# EAGLE design ArduinoClock (EAGLE 9.6.2)
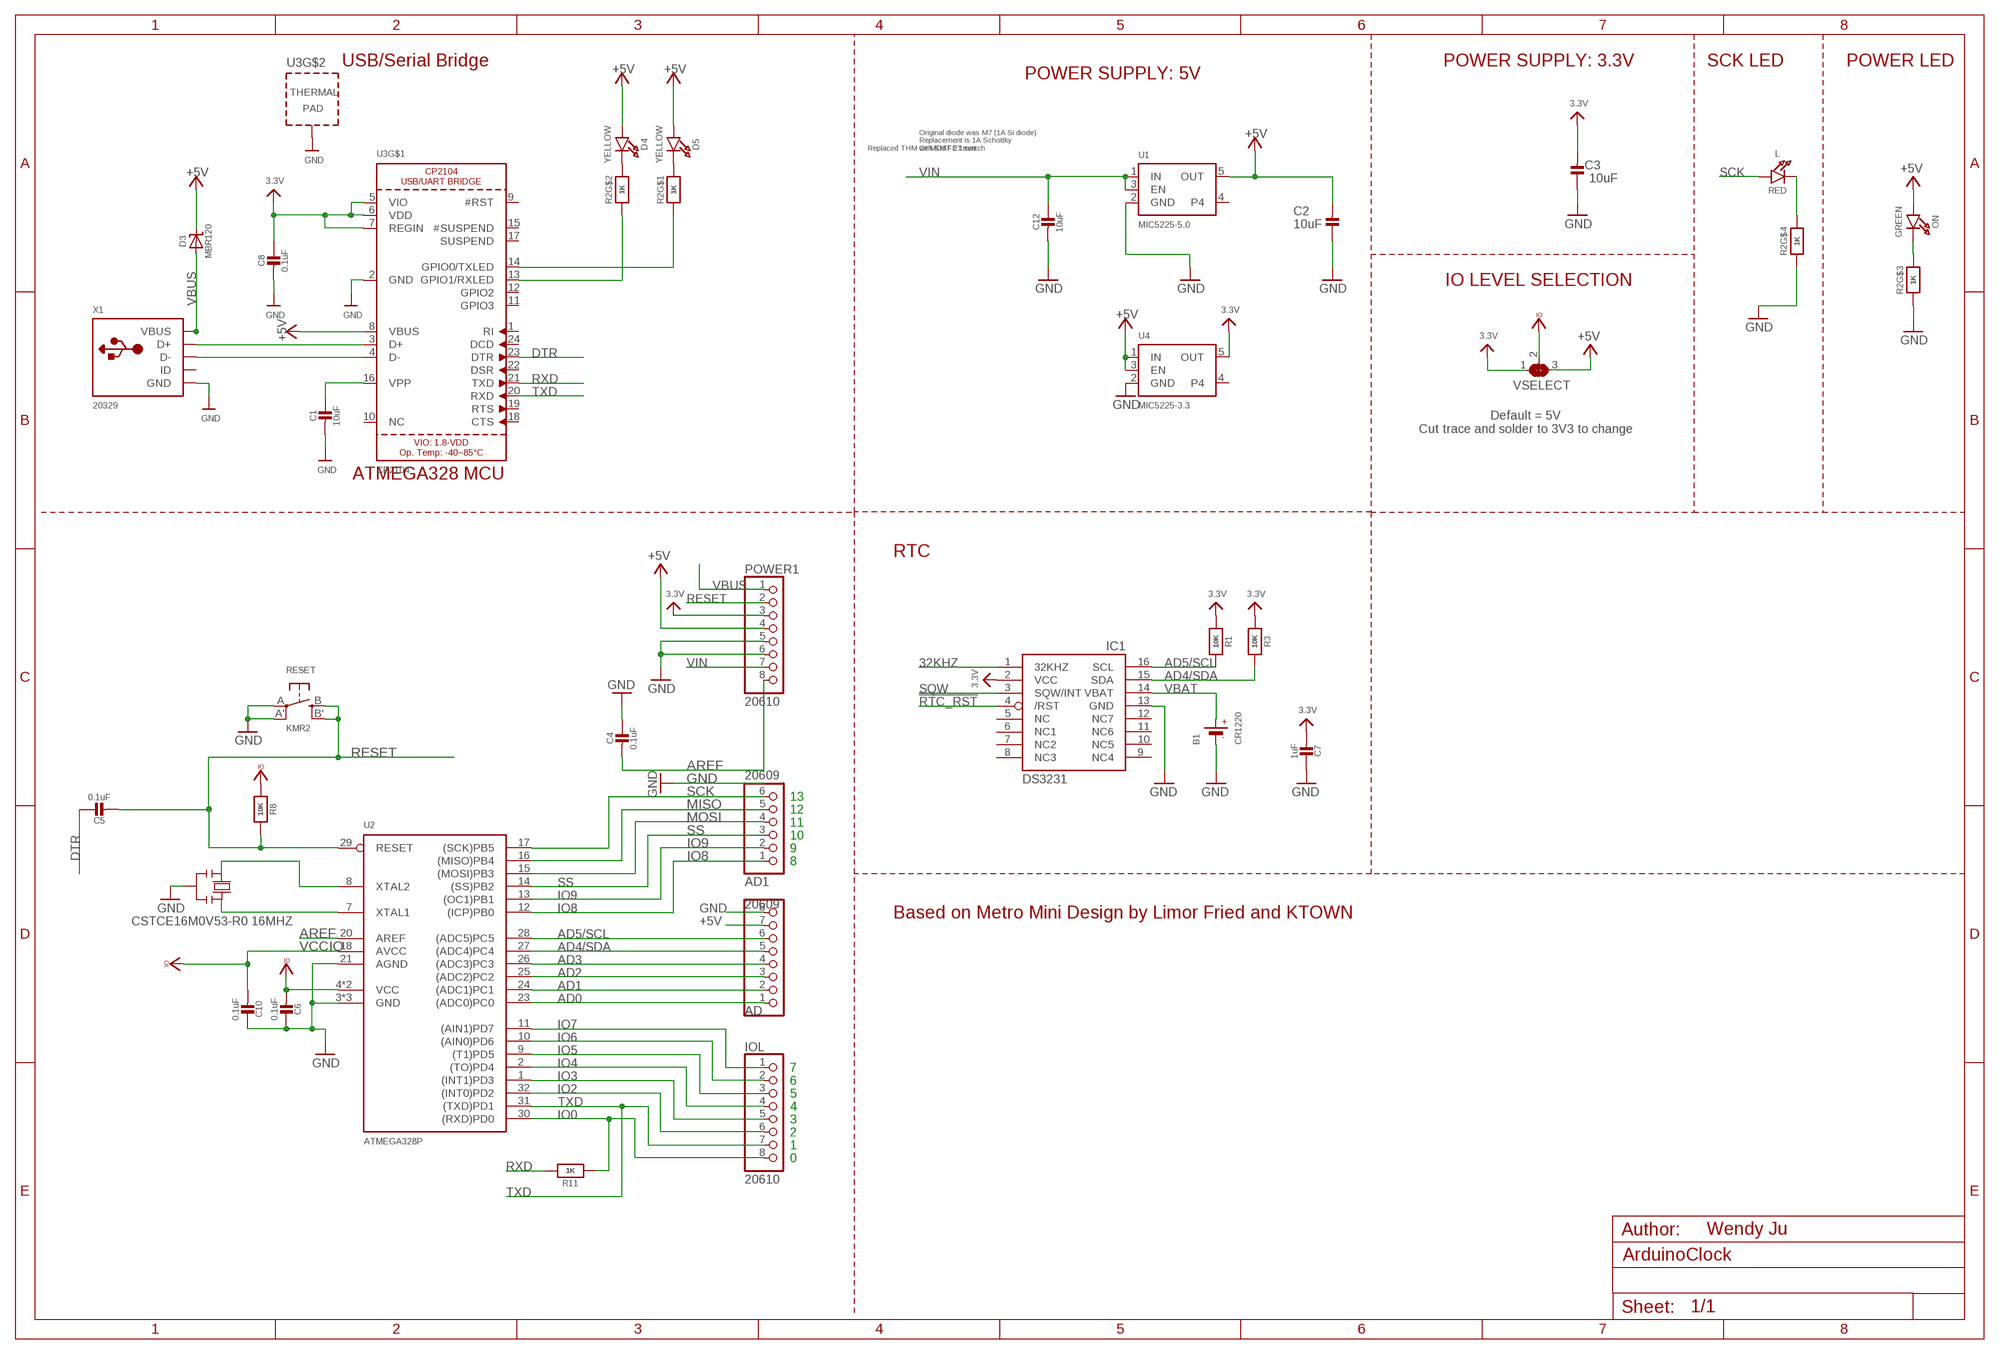
[diagram p0: schematic, sheet 1]

## Parts
AD  20609  HEADER-1X8ROUND  [1X08_ROUND]
AD1  20609  HEADER-1X6ROUND  [1X06_ROUND]
B1  CR1220  BATTERYCR1220_SMT  [CR1220]
C1  10uF  CAP_CERAMIC0805-NOOUTLINE  [0805-NO]
C2  10uF  CAP_CERAMIC0805-NOOUTLINE  [0805-NO]
C3  10uF  CAP_CERAMIC0805-NOOUTLINE  [0805-NO]
C4  0.1uF  CAP_CERAMIC0805-NOOUTLINE  [0805-NO]
C5  0.1uF  CAP_CERAMIC_0805MP  [_0805MP]
C6  0.1uF  CAP_CERAMIC0805-NOOUTLINE  [0805-NO]
C7  1uF  CAP_CERAMIC0805-NOOUTLINE  [0805-NO]
C8  0.1uF  CAP_CERAMIC0805-NOOUTLINE  [0805-NO]
C10  0.1uF  CAP_CERAMIC0805-NOOUTLINE  [0805-NO]
C12  10uF  CAP_CERAMIC0805-NOOUTLINE  [0805-NO]
D3  MBR120  DIODE-SCHOTTKYSOD-123  [SOD-123]
D4  YELLOW  LED0805_NOOUTLINE  [CHIPLED_0805_NOOUTLINE]
D5  YELLOW  LED0805_NOOUTLINE  [CHIPLED_0805_NOOUTLINE]
IC1  DS3231/SO  [SO16W]
IOL  20610  HEADER-1X8ROUND  [1X08_ROUND]
L  RED  LED0805_NOOUTLINE  [CHIPLED_0805_NOOUTLINE]
ON  GREEN  LED0805_NOOUTLINE  [CHIPLED_0805_NOOUTLINE]
POWER1  20610  HEADER-1X870MIL  [1X08_ROUND_70]
R1  10K  RESISTOR0805_NOOUTLINE  [0805-NO]
R2  1K  RESISTOR_4PACK  [RESPACK_4X0603]
R3  10K  RESISTOR0805_NOOUTLINE  [0805-NO]
R8  10K  RESISTOR0805_NOOUTLINE  [0805-NO]
R11  1K  RESISTOR0805_NOOUTLINE  [0805-NO]
RESET  KMR2  SWITCH_TACT_SMT4.6X2.8  [BTN_KMR2_4.6X2.8]
U1  MIC5225-5.0  VREG_SOT23-5  [SOT23-5]
U2  ATMEGA328P  [MLF32-TH]
U3  CP2104  [QFN24_4MM_SMSC]
U4  MIC5225-3.3  VREG_SOT23-5  [SOT23-5]
VSELECT  SOLDERJUMPER_2WAY  [SOLDERJUMPER_2WAY_OPEN_NOPASTE]
X1  20329  USB_MICRO_20329_V2  [4UCONN_20329_V2]
Y2  CSTCE16M0V53-R0 16MHZ  RESONATORMU  [RESONATOR]

## Nets
3.3V: C3.2 C7.2 C8.1 IC1.2(VCC) POWER1.3 R1.1 R3.1 U3.5(VIO) U3.6(VDD) U3.7(REGIN) U4.5(OUT) VSELECT.1
32KHZ: IC1.1(32KHZ)
!RTC_RST: IC1.4(/RST)
+5V [usbvcc]: AD.7 C2.2 D3.C D4.A D5.A ON.A POWER1.4 U1.5(OUT) U3.8(VBUS) U4.1(IN) U4.3(EN) VSELECT.3
AD0: AD.1 U2.23((ADC0)PC0)
AD1: AD.2 U2.24((ADC1)PC1)
AD2: AD.3 U2.25((ADC2)PC2)
AD3: AD.4 U2.26((ADC3)PC3)
AD4/SDA: AD.5 IC1.15(SDA) R3.2 U2.27((ADC4)PC4)
AD5/SCL: AD.6 IC1.16(SCL) R1.2 U2.28((ADC5)PC5)
AREF [aref]: C4.2 POWER1.8 U2.20(AREF)
DTR: C5.1 U3.23(DTR)
GND [power]: AD.8 B1.- C1.2 C2.1 C3.1 C4.1 C6.1 C7.1 C8.2 C10.1 C12.2 IC1.13(GND) POWER1.5 POWER1.6 R2.3 R2.4 RESET.A'(P1) RESET.A(P) U1.2(GND) U2.3(GND) U2.5(GND) U2.21(AGND) U2.TH(GND) U3.2(GND) U3.THERM(TP) U4.2(GND) X1.BASE@1(GND) X1.BASE@2(GND) X1.GND X1.SPRT@1(GND) X1.SPRT@2(GND) X1.SPRT@3(GND) X1.SPRT@4(GND) Y2.2
IO0: IOL.8 R11.1 U2.30((RXD)PD0)
IO2: IOL.6 U2.32((INT0)PD2)
IO3: IOL.5 U2.1((INT1)PD3)
IO4: IOL.4 U2.2((TO)PD4)
IO5: IOL.3 U2.9((T1)PD5)
IO6: IOL.2 U2.10((AIN0)PD6)
IO7: IOL.1 U2.11((AIN1)PD7)
IO8: AD1.1 U2.12((ICP)PB0)
IO9: AD1.2 U2.13((OC1)PB1)
MISO: AD1.5 U2.16((MISO)PB4)
MOSI: AD1.4 U2.15((MOSI)PB3)
N$1: L.C R2.5
N$3: ON.C R2.6
N$4: R2.1 U3.14(GPIO0/TXLED)
N$6: D4.C R2.7
N$7: D5.C R2.8
N$8: U3.3(D+) X1.D+
N$11: U3.4(D-) X1.D-
N$12: C1.1 U3.16(VPP)
N$15: R2.2 U3.13(GPIO1/RXLED)
RESET: C5.2 POWER1.2 R8.1 RESET.B'(S1) RESET.B(S) U2.29(RESET)
RXD: R11.2 U3.21(TXD)
SCK: AD1.6 L.A U2.17((SCK)PB5)
SQW: IC1.3(SQW/INT)
SS: AD1.3 U2.14((SS)PB2)
TXD: IOL.7 U2.31((TXD)PD1) U3.20(RXD)
VBAT: B1.+$1(+) IC1.14(VBAT)
VBUS: D3.A POWER1.1 X1.VBUS
VCCIO [usbvcc]: C6.2 C10.2 R8.2 U2.4(VCC) U2.6(VCC) U2.18(AVCC) VSELECT.2
VIN [power]: C12.1 POWER1.7 U1.1(IN) U1.3(EN)
XTAL1: U2.7(XTAL1) Y2.3
XTAL2: U2.8(XTAL2) Y2.1
Unconnected: IC1.5(NC) IC1.6(NC1) IC1.7(NC2) IC1.8(NC3) IC1.9(NC4) IC1.10(NC5) IC1.11(NC6) IC1.12(NC7) U1.4 U3.1(RI) U3.9(#RST) U3.10(NC) U3.11(GPIO3) U3.12(GPIO2) U3.15(#SUSPEND) U3.17(SUSPEND) U3.18(CTS) U3.19(RTS) U3.22(DSR) U3.24(DCD) U4.4 X1.ID

## Notes on the sheet
- USB/Serial Bridge | POWER SUPPLY: 3.3V | SCK LED | POWER LED
- POWER SUPPLY: 5V
- Replaced THM with SMT 2.1mm
- Original diode was M7 (1A Si diode)
  Replacement is 1A Schottky
  Or MOSFET switch
- IO LEVEL SELECTION
- Default = 5V
  Cut trace and solder to 3V3 to change
- ATMEGA328 MCU
- RTC
- 13
- 12
- 11
- 10
- 9
- 8
- Based on Metro Mini Design by Limor Fried and KTOWN
- 7
- 6
- 5
- 4
- 3
- 2
- 1
- 0
- Wendy Ju

## Library data of the parts
AD IOL POWER1 = microbuilder:HEADER-1X8: PIN HEADER
AD1 = microbuilder:HEADER-1X6: PIN HEADER
B1 = microbuilder:BATTERY: CR1220 SMT - Digikey: 3001K-ND CD2032 BAT-HLD-001 - Digikey: BAT-HLD-001-ND
C1-C8 C10 C12 = microbuilder:CAP_CERAMIC: Ceramic Capacitors For new designs, use the packages preceded by an '_' character since they are more reliable: The following footprints should be used on most boards: _0402 - Standard footprint for regular board layouts _0603 - Standard footprint for regular board layouts _0805 - Standard footprint for regular board layouts _1206 - Standard footprint for regular board layouts For extremely tight-pitch boards where space is at a premium, the following 'micro-pitch' footprints can be used (smaller pads, no silkscreen outline, etc.): _0402MP - Micro-pitch footprint for very dense/compact boards _0603MP - Micro-pitch footprint for very dense/compact boards _0805MP - Micro-pitch footprint for very dense/compact boards _1206MP - Micro-pitch footprint for very dense/compact boards
D3 = microbuilder:DIODE-SCHOTTKY
D4 D5 L ON = microbuilder:LED: LED 0603 - 0603 Surface Mount Package 2mA: Green LED - Low Power (3.9mcd, 2ma, 1.7Vf) - Digikey: 475-2709-2-ND Orange LED - Low Power (9.8mcd, 2ma, 1.8Vf) - Digikey: 475-1194-2-ND Red LED - Low Power (5mcd, 2ma, 1.8Vf) - Digikey: 475-1195-2-ND Yellow LED - Low Power (7mcd, 2ma, 1.8Vf) - Digikey: 475-1196-2-ND 5mA: Blue LED - Low Power (17mcd, 5ma, 2.9Vf) - Digikey: LNJ937W8CRACT-ND 0805 - 0805 Surface Mount Package 2mA: Red LED (8.8mcd, 2mA, 1.8Vf, Clear) - Low Power [Digikey: 475-2510-1-ND] Green LED (5mcd, 2mA, 1.8Vf, Clear) - Low Power [Digikey: 475-2730-1-ND] Yellow LED (11.3mcd, 2mA, 1.8Vf, Clear) - Low Power [Digikey: 475-2555-1-ND] 20mA: Red LED (104mcd, 20mA, Diffused) - LS R976 [Digikey: 475-1278-6-ND] Red LED (12mcd, 20mA, 2.0Vf, Clear) - APT2012EC [Digikey: 754-1128-1-ND] Green LED (15mcd, 20mA, 2.2Vf, Clear) - APT2012GC [Digikey: 754-1131-1-ND] Orange LED (160mcd, 20mA, 2.1Vf, Clear) - APT2012SECK [Digikey: 754-1130-1-ND] 1206 - 1206 Surface Mount Package Green LED (26mcd, 20mA, Diffused) - LG N971 [Digikey: 475-1407-6-ND] Red LED (15mcd, 20mA, Diffused) - LH N974 [Digikey: 475-1416-6-ND] Cree - Cree High-Power Surface Mount LEDs XPEBWT-L1-0000-00D50 - White 111lm 350mA 2.9Vf 6200K 110° XTEAWT-00-0000-00000LEE3 - White 114lm 350mA 2.85Vf 5000K 115° Everlight - Everlight 45-21 Series Surface Mount LEDs 45-21/QK2C-B2832AC2CB2/2T - Warm White 2000mcd 20mA 3.25Vf 3050K 120° 45-21/LK2C-B38452C4CB2/2T - Nuetral White 2000mcd 20mA 3.25Vf 4150K 120° 45-21/LK2C-B50634C6CB2/2T - Cold White 2200mcd 20mA 3.25Vf 5650K 120° PLCC2 Reverse Mount LS T77K-J1L2-1-0-2-R18-Z - Red 11.25mcd 2mA 1.8Vf 630nm 120° LO T77K-L1M2-24-Z - Orange 19.6mcd 2mA 1.8Vf 606nm 120° LY T77K-K2M1-26-Z - Yellow 15.7mcd 2mA 1.8Vf 587nm 120°
IC1 = adafruit:DS3231
R1 R3 R8 R11 = microbuilder:RESISTOR: Resistors For new designs, use the packages preceded by an '_' character since they are more reliable: The following footprints should be used on most boards: _0402 - Standard footprint for regular board layouts _0603 - Standard footprint for regular board layouts _0805 - Standard footprint for regular board layouts _1206 - Standard footprint for regular board layouts For extremely tight-pitch boards where space is at a premium, the following 'micro-pitch' footprints can be used (smaller pads, no silkscreen outline, etc.): _0402MP - Micro-pitch footprint for very dense/compact boards _0603MP - Micro-pitch footprint for very dense/compact boards _0805MP - Micro-pitch footprint for very dense/compact boards _1206MP - Micro-pitch footprint for very dense/compact boards
R2 = microbuilder:RESISTOR_4PACK: Resistor Packs (4 resistors) 4 x 0603 10K 1/16W - Digikey: YC164J-10KCT-ND
RESET = microbuilder:SWITCH_TACT_SMT: SMT Tact Switches 6x6mm - Digikey: P12940SCT-ND KMR2 (4.6x2.8mm) - Digikey: 401-1426-1-ND EVQ-PQHB55 - Light Touch, 160GF (4.5x4.5mm) - Digikey: P8090SCT-ND KMT0 - KMT021 NGJ LHS (etc.) IP68/Waterproof - Digikey: CKN10289CT-ND
U1 U4 = microbuilder:VREG_SOT23-5: SOT23-5 Fixed Voltage Regulators Part Current Out V Out V In V Dropout θJA (°C/W) TJ (°C) Digikey Part No. ADP121 150mA 3.3V 3.4-5.5V 0.09V @ 150mA -- -- ADP121-AUJZ33R7CT-ND ADP121 150mA 3.0V 3.1-5.5V 0.09V @ 150mA -- -- ADP121-AUJZ30R7CT-ND ADP122 300mA 3.3V 3.4-5.5V 0.085V @ 300mA -- -- ADP122AUJZ-3.3-R7CT-ND ADP1712 300mA 3.3V 3.5-5.5V 0.17V @ 300mA -- -- ADP1712AUJZ-3.3-R7TR-ND AP7311 (Low Cost) 150mA 3.3V 3.5-6V 0.15V @ 150mA -- -- AP7311-33WG-7DICT-ND LD39015M18R 150mA 1.8V 1.9V-5.5V 0.08V @ 100mA -- -- 497-6977-1-ND LP2985A-33DBVR 150mA 3.3V 3.3-16V 0.28V @ 150mA 206 150 296-18479-1-ND MCP1824T-3302E/OT 300mA 3.3V 3.5V-6V 0.2V @ 300mA -- -- MCP1824T-3302E/OTCT-ND MIC5205-2.5YM5 TR 150mA 2.5V 2.7-16V 0.165V @ 150mA -- -- 576-1257-2-ND MIC5205-3.0YM5 TR 150mA 3.0V 3.2V-16V 0.165V @ 150mA -- -- 576-1258-2-ND MIC5205-3.3YM5 TR 150mA 3.3V 3.5V-16V 0.165V @ 150mA -- -- 576-1259-2-ND TPS780330220 150mA 3.3V+2.2V 3.6-5.5V 250mV Max -- -- 296-23332-1-ND TDA3663/N1,135 100mA 3.3V 3.5-45V 0.18V @ 50mA -- -- 568-5343-1-ND Max operating temp can be calculated using θJA, TJ (max junction temperature), and power in watts. Set the "Maximum Ambient Temperature" until it reaches TJ ("Max Junction Temperature"), which is the absolute limit for safe use of the regulator: Heat Sink Temperature Calculator <http://www.daycounter.com/Calculators/Heat-Sink-Temperature-Calculator.phtml> For example, With 12V source into a 3.3V LP2985 and a 30mA load, we are dissipating (12V-3.3V) * 0.03A = 0.261W. With a θJA of 206 °C/W, a TJ of 150°C, and 261mW we can safely use the chip without a heat sink up to 75°C (=147.1°C Junction Temperature).
U2 = microbuilder:ATMEGA328P: ATMEGA 328P
U3 = microbuilder:CP2104: CP2104 - USB to UART Bridge VDD Output: 3.45V
VSELECT = microbuilder:SOLDERJUMPER_2WAY: 2-Way Solder Jumper
X1 = microbuilder:USB: USB Connectors USBMINIB - Surface Mount Female Mini-B USB Connector 4UConnector: 06564
Y2 = SmartPrj:RESONATOR

## Net classes
1 power: width 0.305 mm, drill 0.483 mm, clearance 0.203 mm
2 gnd: width 0.305 mm, drill 0.483 mm, clearance 0.203 mm
3 usbvcc: width 0.305 mm, drill 0.483 mm, clearance 0.203 mm
4 aref: width 0.254 mm, drill 0.483 mm, clearance 0.203 mm

## Board
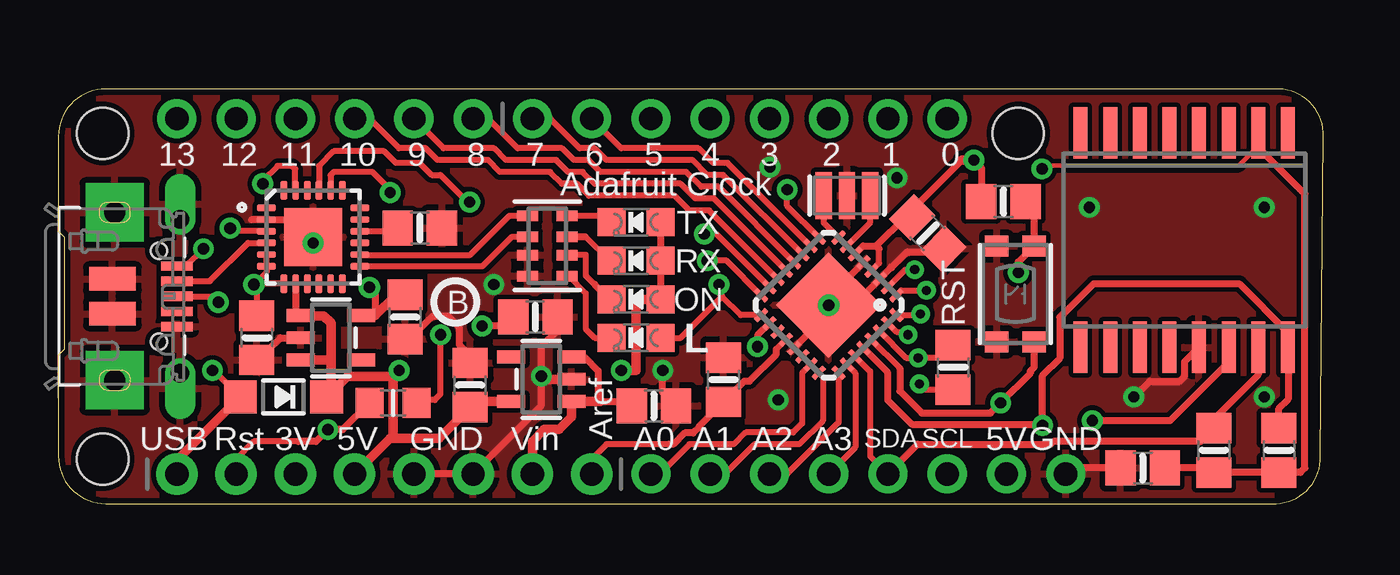
[diagram p1: board, top side]
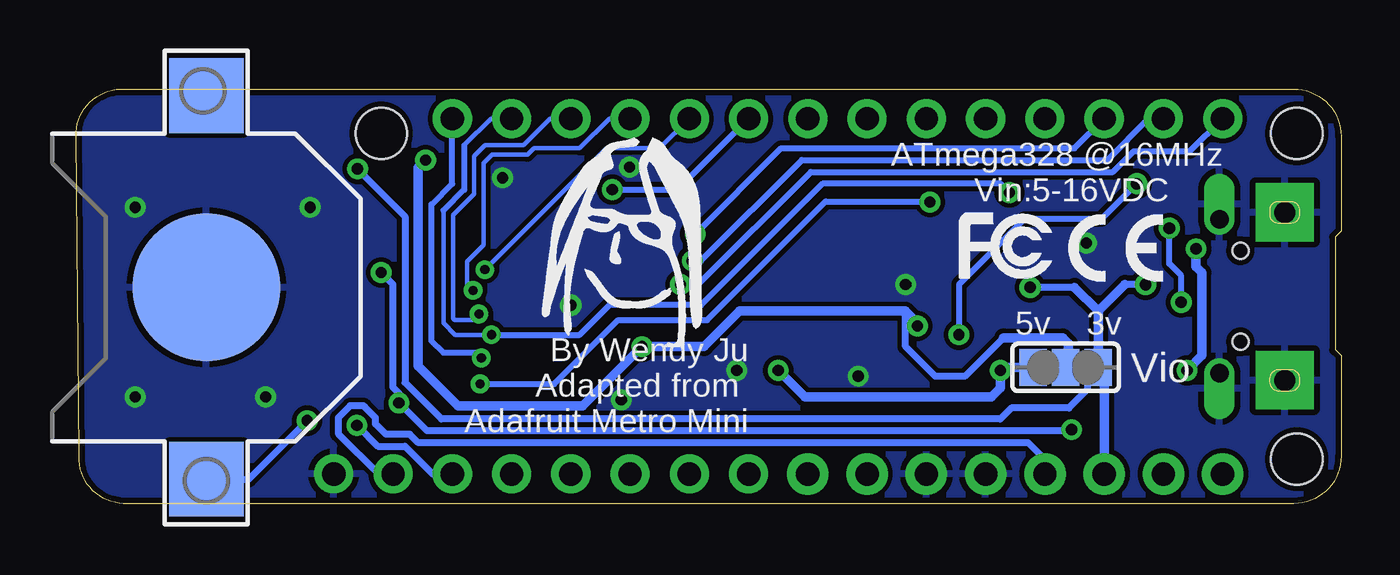
[diagram p2: board, bottom side, seen from below]

Size 54.23 x 17.78 mm. Coordinates in mm from the lower left corner, seen from the top.
Outline: 0,15.75 0,11.68 0.25,11.43 0.25,6.6 0,6.35 0,2.03 arc90 2.03,0 52.2,0 arc90 54.1,2.03 54.23,15.75 arc90 52.32,17.78 2.03,17.78 arc90 0,15.75
Copper layers (1*16): Top 0.035mm / dielectric 1.5mm / Bottom 0.035mm
Design rules "adafruit *": minimum track width 8mil, minimum drill 15.5mil, track to track 8mil, track to pad 8mil, pad to pad 8mil, via to via 8mil, smd to smd 8mil, copper to edge 10mil, drill to drill 8mil, minimum pad ring 10mil, minimum via ring 8mil, stop-mask expansion 2mil, vias tented up to drill 20mil, thermal gap 10mil
Holes 2.2 mm at 1.91,15.88 1.91,1.91 41.15,15.88

### Footprints (pad centres in the part's own frame; a part is rotated, then mirrored left to right if it is on the bottom)
1X08_ROUND = drill 1 pad 1.676: 1 -8.89,0; 2 -6.35,0; 3 -3.81,0; 4 -1.27,0; 5 1.27,0; 6 3.81,0; 7 6.35,0; 8 8.89,0
1X06_ROUND = drill 1 pad 1.676: 1 -6.35,0; 2 -3.81,0; 3 -1.27,0; 4 1.27,0; 5 3.81,0; 6 6.35,0
CR1220 = smd 3.2 x 3.2: +$1 -8.225,0; +$2 8.225,0 | smd 6.35 x 6.35: - 0,0
0805-NO = smd 1.3 x 1.5: 1 -0.95,0; 2 0.95,0
_0805MP = smd 1.2 x 1.3: 1 -1.016,0; 2 1.016,0
SOD-123 = smd 1.4 x 1.4: A 1.85,0; C -1.85,0
CHIPLED_0805_NOOUTLINE = smd 1.2 x 1.2: A 0,-1.05; C 0,1.05
SO16W = smd 0.6 x 2.2: 1 -4.445,-4.6; 2 -3.175,-4.6; 3 -1.905,-4.6; 4 -0.635,-4.6; 5 0.635,-4.6; 6 1.905,-4.6; 7 3.175,-4.6; 8 4.445,-4.6; 9 4.445,4.6; 10 3.175,4.6; 11 1.905,4.6; 12 0.635,4.6; 13 -0.635,4.6; 14 -1.905,4.6; 15 -3.175,4.6; 16 -4.445,4.6
1X08_ROUND_70 = drill 1 pad 1.778: 1 -8.89,0; 2 -6.35,0; 3 -3.81,0; 4 -1.27,0; 5 1.27,0; 6 3.81,0; 7 6.35,0; 8 8.89,0
RESPACK_4X0603 = smd 0.45 x 0.9: 1 -1.3,-0.85; 2 -0.4,-0.85; 3 0.4,-0.85; 4 1.3,-0.85; 5 1.3,0.85; 6 0.4,0.85; 7 -0.4,0.85; 8 -1.3,0.85
BTN_KMR2_4.6X2.8 = smd 0.9 x 1: A 2.05,0.8; A' -2.05,0.8; B 2.05,-0.8; B' -2.05,-0.8
SOT23-5 = smd 0.55 x 1.2: 1 -0.95,-1.3; 2 0,-1.3; 3 0.95,-1.3; 4 0.95,1.3; 5 -0.95,1.3
MLF32-TH = smd 0.7 x 0.25: 1 -2.35,1.75; 2 -2.35,1.25; 3 -2.35,0.75; 4 -2.35,0.25; 5 -2.35,-0.25; 6 -2.35,-0.75; 7 -2.35,-1.25; 8 -2.35,-1.75; 17 2.35,-1.75; 18 2.35,-1.25; 19 2.35,-0.75; 20 2.35,-0.25; 21 2.35,0.25; 22 2.35,0.75; 23 2.35,1.25; 24 2.35,1.75 | smd 0.25 x 0.7: 9 -1.75,-2.35; 10 -1.25,-2.35; 11 -0.75,-2.35; 12 -0.25,-2.35; 13 0.25,-2.35; 14 0.75,-2.35; 15 1.25,-2.35; 16 1.75,-2.35; 25 1.75,2.35; 26 1.25,2.35; 27 0.75,2.35; 28 0.25,2.35; 29 -0.25,2.35; 30 -0.75,2.35; 31 -1.25,2.35; 32 -1.75,2.35 | smd 3.2 x 3.2: TH 0,0
QFN24_4MM_SMSC = smd 0.8 x 0.28: 1 -2,1.25; 2 -2,0.75; 3 -2,0.25; 4 -2,-0.25; 5 -2,-0.75; 6 -2,-1.25; 13 2,-1.25; 14 2,-0.75; 15 2,-0.25; 16 2,0.25; 17 2,0.75; 18 2,1.25 | smd 0.28 x 0.8: 7 -1.25,-2; 8 -0.75,-2; 9 -0.25,-2; 10 0.25,-2; 11 0.75,-2; 12 1.25,-2; 19 1.25,2; 20 0.75,2; 21 0.25,2; 22 -0.25,2; 23 -0.75,2; 24 -1.25,2 | smd 2.5 x 2.5: THERM 0,0
SOLDERJUMPER_2WAY_OPEN_NOPASTE = smd 1.168 x 1.6: 1 -1.397,0; 2 0,0; 3 1.397,0
4UCONN_20329_V2 = smd 1 x 2: BASE@1 -0.75,-2; BASE@2 0.75,-2 | smd 0.4 x 1.35: D+ 0,0.775; D- -0.65,0.775; GND 1.3,0.775; ID 0.65,0.775; VBUS -1.3,0.775 | drill 0.8 pad 1.2 offset: SPRT@1 -3.3,0.9; SPRT@2 3.3,0.9 | drill 0.9 pad 2.5 square: SPRT@3 -3.6,-1.9; SPRT@4 3.6,-1.9 | hole 0.7: -1.95,0; 1.95,0
RESONATOR = smd 0.7 x 2: 1 -1,0; 2 0,0; 3 1,0

### Placement (x,y rotation side)
AD  34.29,1.27 0 top
AD1  11.43,16.51 180 top
B1  48.64,9.27 90 bottom
C1  15.49,11.81 0 top
C2  17.65,5.08 270 top
C3  8.51,7.11 90 top
C4  28.51,5.31 270 top
C5  14.35,4.32 180 top
C6  20.45,8 180 top
C7  46.48,1.52 0 top
C8  14.86,8 270 top
C10  37.27,11.6 135 top
C12  25.53,4.19 0 top
D3  9.65,4.57 180 top
D4  24.77,10.41 90 top
D5  24.77,12.06 90 top
IC1  48.26,11.3 180 top
IOL  29.21,16.51 0 top
L  24.77,7.11 90 top
ON  24.77,8.76 90 top
POWER1  13.97,1.27 0 top
R1  52.32,2.29 90 top
R2  20.95,11.05 270 top
R3  49.53,2.29 90 top
R8  40.51,12.95 180 top
R11  38.35,5.84 270 top
RESET  41.02,8.99 90 top
U1  20.7,5.33 90 top
U2  33.02,8.51 225 top
U3  10.92,11.43 0 top
U4  11.68,7.11 270 top
U$4  [PCBFEAT-REV-040]  17.02,8.64 0 top
U$12  [SYMBOL_CE_TINY]  11.68,9.53 0 bottom
U$14  [SYMBOL_FCC_TINY]  16.38,9.65 0 bottom
VSELECT  11.81,5.84 180 bottom
X1  4.32,8.89 270 top
Y2  33.8,13.21 0 top

### Tracks (layer width: path | path; a pad name or v marks a point on that pad's centre or on a via)
3.3V  (via drill 0.48, 0.5)
  Top 0.203: v42.16,14.35 42.31,14.5 50.59,14.5 51.36,15.27 51.44,15.27
  Top 0.254: U3.5 U3.6 8.92,9.93 8.43,9.43 | U3.7 8.43,9.43 | 8.43,9.43 8.39,9.4 v8.38,9.4 8.51,9.27 C3.2
  Top 0.305: v13.34,9.27 13.59,9.02 13.59,8.06 | C7.2 49.53,1.52 R3.1 R1.1 53.24,1.34 53.43,1.53 53.43,13.28 51.44,15.27 IC1.2
  Top 0.406: U4.5 13.59,8.06 14.48,8.95 C8.1
  Bottom 0.305: 11.43,9.27 v13.34,9.27 | VSELECT.1 10.87,5.38 10.87,4.89 11.66,4.1 14.14,4.1 14.62,3.63 38.57,3.63 40.13,5.2 40.13,12.32 v42.16,14.35 | v8.38,9.4 9.27,9.4
  Bottom 0.406: POWER1.3 10.16,5.59 VSELECT.1 10.41,8.26 | 11.43,9.27 10.41,8.26 | 9.27,9.4 10.41,8.26
+5V  (via drill 0.48)
  Top 0.305: D5.A D4.A ON.A | 10.17,8.27 U4.1 10.17,8.25 U3.8
  Top 0.406: ON.A 24.77,8.76 24.77,5.71 v24.13,5.71 | 14.35,5.46 14.35,2.79 | POWER1.4 14.22,2.79 14.35,2.79 | 14.35,2.79 16.32,2.79 C2.2 17.91,4.38 U1.5 | 14.35,5.46 12.39,5.46 D3.C 11.68,4.75 11.68,6.1 | v14.61,5.71 14.35,5.46 | U4.1 11.38,8.05 11.68,7.75 11.68,6.1 | U4.3 11.62,6.16 11.68,6.1
  Bottom 0.305: POWER1.4 12.7,1.91 13.41,2.61 39.56,2.61 39.92,2.97 40.95,2.97 41.39,3.42 41.39,3.68 41.86,4.15 41.87,4.15 41.91,4.19 42.48,4.19 42.99,3.68 42.99,3 41.26,1.27 AD.7
  Bottom 0.406: v24.13,5.71 22.99,4.57 14.99,4.57 14.61,4.95 v14.61,5.71 14.48,5.84 VSELECT.3
AD0
  Top 0.254: U2.23 31.88,5.6 31.88,3.43 31.5,3.05 29.46,3.05 28.96,2.54 27.05,2.54 25.78,1.27 AD.1
AD1
  Top 0.254: U2.24 32.77,5.44 32.77,3.56 31.75,2.54 29.84,2.54 28.57,1.27 AD.2
AD2
  Top 0.254: U2.25 33.44,3.47 31.24,1.27 AD.3
AD3
  Top 0.254: U2.26 34.16,5.6 34.16,2.41 AD.4
AD4/SDA
  Top 0.254: U2.27 34.8,5.67 34.8,2.03 AD.5
  Top 0.305: IC1.15 51.44,5.52 49.53,3.61 R3.2 48.96,2.67 42.66,2.67 42.53,2.54 36.83,2.54 AD.5
AD5/SCL  (via drill 0.48)
  Top 0.305: U2.28 35.56,5.62 35.56,4.43 36.61,3.38 42.16,3.38 v42.19,3.35 42.16,3.35 42.16,5.47 42.93,6.23 42.93,8 43.05,8.13 43.08,8.13 44.38,9.43 50.61,9.43 52.7,7.34 IC1.16 52.72,6.69 52.72,4.47 52.32,4.08 R1.2
  Bottom 0.305: AD.6 38.94,1.27 40.13,2.46 41.3,2.46 v42.19,3.35
AREF
  Top 0.254: 26.16,2.54 23.5,2.54 22.86,1.91 POWER1.8 | 30.77,6.63 U2.20
  Top 0.305: C4.2 28.77,4.36 | C4.2 27.48,3.33 27.48,3.29 27.21,3.02 26.85,3.02 26.37,2.54 26.16,2.54 | C4.2 29.41,5.26 29.63,5.26 30.77,6.4 30.77,6.63
DTR  (via drill 0.48, 0.5)
  Top 0.254: v16.38,7.24 16.38,4.7 16.13,4.45 15.49,4.45 C5.1 | U3.23 10.16,13.44 10.16,14.35 10.03,14.48 9.4,14.48 8.76,13.84 v8.76,13.72
  Bottom 0.254: v8.76,13.72 10.29,12.19 13.59,12.19 16.38,9.4 v16.38,7.24
GND  (via drill 0.48, 0.5)
  Top 0.305: 21.4,7.43 20.7,6.73 v20.7,5.46 20.7,4.19 POWER1.6 POWER1.5 | U3.THERM 10.17,12.18 U3.2 8.27,12.18 | C3.1 8.95,6.6 9.02,6.6 9.53,7.11 U4.2 | C8.2 15.05,7.05 16.04,8.04 16.71,8.04 17.18,7.57 17.18,6.82 17.65,6.35 C2.1 | C7.1 43.43,1.52 | v25.91,5.71 25.91,4.76 C12.2 26.65,4.36 | 34.08,8.51 U2.TH | U2.TH 33.02,8.13 33.7,8.13 U2.3 35.69,10.12 | U2.5 33.02,8.86 U2.TH | U2.21 33.02,8.15 U2.TH | v46.1,4.57 46.78,5.25 48.07,5.25 48.28,5.46 48.28,6.09 IC1.13 | 35.69,10.15 35.69,10.12 | 35.69,10.12 35.72,10.12 36.38,10.79 37.8,10.79 C10.1
  Top 0.406: C12.2 26.48,4.73 | v20.7,5.46 20.83,5.33 U1.2 | 21.4,7.43 C6.1
  Bottom 0.305: B1.- 48.64,6.99
  other vias: 33.02,8.51 18.67,9.4 10.92,11.18 51.69,4.57 35.94,13.97 44.2,12.7 30.51,14.43 51.69,12.7 30.86,4.45
  pour Top: 0,17.78 0,0 54.23,0 54.23,17.78
  pour Bottom: 0,17.78 0,0 54.1,0 54.1,17.78
IO0  (via drill 0.39)
  Top 0.254: U2.30 36.34,6.25 v36.85,6.25 38.12,6.25 38.35,6.48 R11.1
  Bottom 0.254: v36.85,6.25 37.08,6.48 38.48,6.48 38.99,6.99 38.99,12.83 38.1,13.72 IOL.8
IO2  (via drill 0.39)
  Top 0.254: U2.32 36.91,8.09 v36.96,8.13
  Bottom 0.203: IOL.6 33.91,16.51 35.05,15.37 36.7,15.37 37.16,14.91 37.16,13.28 38.06,12.38 38.06,7.95 37.99,7.87 37.21,7.87 v36.96,8.13
IO3  (via drill 0.39)
  Top 0.254: U2.1 36.13,9.14 v37.21,9.14
  Bottom 0.203: IOL.5 31.37,16.51 32.64,15.24 34.6,15.24 34.88,14.96 36.4,14.96 36.75,14.61 36.75,11.08 37.47,10.37 37.47,9.4 v37.21,9.14
IO4  (via drill 0.39)
  Top 0.254: U2.2 36.31,10.03 v36.7,10.03
  Bottom 0.203: IOL.4 29.21,15.24 31.5,15.24 v36.7,10.03
IO5  (via drill 0.48)
  Top 0.254: U2.9 31.24,12.76 v31.24,13.46
  Bottom 0.254: v31.24,13.46 28.45,13.46 IOL.3
IO6
  Top 0.254: U2.10 28.69,14.61 28.07,14.61 27.43,15.24 24.13,15.24 IOL.2
IO7
  Top 0.254: U2.11 28.49,14.1 27.81,14.1 27.18,14.73 23.5,14.73 22.99,15.24 22.35,15.24 21.08,16.51 IOL.1
IO8
  Top 0.254: U2.12 28.29,13.59 27.56,13.59 26.92,14.22 23.24,14.22 22.73,14.73 22.1,14.73 21.59,15.24 19.68,15.24 18.41,16.51 AD1.1
IO9
  Top 0.254: U2.13 28.09,13.08 27.3,13.08 26.67,13.72 22.99,13.72 22.48,14.22 21.84,14.22 21.34,14.73 19.18,14.73 18.67,15.24 16.51,15.24 AD1.2
MISO  (via drill 0.48)
  Top 0.254: U2.16 28.64,10.41 v27.81,10.41
  Bottom 0.254: v27.81,10.41 27.43,10.41 23.11,14.73 10.03,14.73 8.26,16.51 AD1.5
MOSI  (via drill 0.48)
  Top 0.254: U2.15 28.2,11.56 v27.69,11.56
  Bottom 0.254: v27.69,11.56 24,15.24 11.43,15.24 AD1.4
N$1
  Top 0.254: L.C 22.99,7.11 22.61,7.49 22.61,9.02 21.87,9.75 R2.5
N$3
  Top 0.254: R2.6 22.59,10.65 22.61,10.67 22.61,9.78 22.99,9.4
  Top 0.305: 22.99,9.4 23.62,8.76 ON.C
N$4
  Top 0.254: U3.14 12.93,10.67 17.65,10.67 19.33,12.35 R2.1
N$6
  Top 0.254: D4.C 23.62,10.41 22.59,11.45
  Top 0.305: R2.7 22.59,11.45
N$7
  Top 0.254: R2.8 23.43,12.35 D5.C
N$8  (via drill 0.5)
  Top 0.254: X1.D+ 6.6,8.89 v6.86,8.64 | U3.3 7.5,11.68 v7.37,11.81
  Bottom 0.254: v6.86,8.64 6.86,9.78 7.37,10.29 v7.37,11.81
N$11
  Top 0.254: X1.D- 6.49,9.54 8.13,11.18 U3.4
N$12
  Top 0.254: U3.16 14.41,11.68 C1.1
N$15
  Top 0.254: U3.13 18.18,10.18 19.45,11.45 R2.2
RESET  (via drill 0.48)
  Top 0.254: U2.29 36.07,5.82 | 10.29,2.67 8.38,2.67 7.62,1.91 POWER1.2 | 13.34,4.19 C5.2
  Top 0.305: 36.07,5.82 36.07,4.83 37.01,3.89 39.95,3.89 v40.39,4.32 41.66,5.59 41.66,5.68 41.82,5.85 RESET.B' | C5.2 12.19,3.17 v11.56,3.17 11.05,2.67 10.29,2.67 | R8.1 41.82,12.6 RESET.B 41.15,10.37 v41.15,9.91
  Bottom 0.305: v11.56,3.17 11.61,3.12 39.19,3.12 v40.39,4.32 40.39,4.73 40.64,4.99 40.64,9.4 v41.15,9.91
RXD  (via drill 0.39, 0.48)
  Top 0.254: R11.2 38.34,4.88 37.16,4.88 v36.91,5.13 | U3.21 11.17,14.47 11.81,15.11 13.97,15.11 14.48,14.61 15.49,14.61 16,14.1 16.38,14.1 17.55,12.93 v17.63,12.93
  Bottom 0.254: v17.63,12.93 17.65,12.95 22.1,12.95 27.18,7.87 30.99,7.87 33.73,5.13 v36.91,5.13
SCK  (via drill 0.48)
  Top 0.254: U2.17 29.25,8.09 28.45,8.89 | 28.45,8.89 28.32,9.02 v28.32,9.4 | L.A 26.67,7.11 28.45,8.89
  Bottom 0.254: v28.32,9.4 27.56,9.4 22.73,14.22 9.78,14.22 8.89,15.11 6.48,15.11 AD1.6
SS
  Top 0.254: U2.14 27.89,12.57 27.05,12.57 26.42,13.21 22.73,13.21 22.23,13.72 21.59,13.72 21.08,14.22 18.92,14.22 18.41,14.73 16.26,14.73 15.75,15.24 14.61,15.24 13.34,16.51 AD1.3
TXD  (via drill 0.39, 0.48)
  Top 0.254: U2.31 35.93,7.37 36.3,7.37 v36.42,7.24 | v14.22,13.34 14.22,13.59 14.1,13.59 13.46,14.22 11.81,14.22 11.67,14.09 U3.20
  Bottom 0.203: IOL.7 36.45,16.51 37.59,15.37 | 38.48,12.57 38.48,7.75 37.97,7.24 v36.42,7.24
  Bottom 0.254: 38.48,12.57 37.59,13.46 37.59,15.37 | v14.22,13.34 14.61,13.72 22.23,13.72 27.43,8.51 31.37,8.51 32.64,7.24 v36.42,7.24
VBAT  (via drill 0.48)
  Top 0.305: IC1.14 50.19,6.68 50.19,6.09 47.65,3.56 v44.32,3.56
  Bottom 0.305: B1.+$1 46.83,1.05 v44.32,3.56
VBUS  (via drill 0.48)
  Top 0.254: X1.VBUS 5.49,10.19 v6.22,10.92 | v6.6,5.71 6.66,5.71 D3.A
  Top 0.406: D3.A 5.08,1.85 POWER1.1
  Bottom 0.406: v6.6,5.71 5.97,6.35 5.97,9.91 6.22,10.16 v6.22,10.92
VCCIO  (via drill 0.48)
  Top 0.254: U2.4 35.18,10.31 35.18,10.92 | U2.6
  Top 0.305: 38.73,14.73 36.6,12.6 C10.2 36.28,12.28 35.05,11.05 | C6.2 19.5,7.62 v18.16,7.62 | U2.18 29.97,7.23 v29.97,6.73 | v39.24,14.73 39.56,14.41 R8.2 | 35.18,10.92 35.05,11.05 | U2.6 34.5,11.05 35.05,11.05
  Top 0.406: 38.73,14.73 v39.24,14.73
  Bottom 0.305: 14.48,7.11 16.13,5.46 17.4,5.46 18.67,6.73 18.67,8.26
  Bottom 0.406: v39.24,14.73 39.56,14.41 39.56,5.91 37.85,4.19 32.51,4.19 v29.97,6.73 27.3,6.73 25.78,8.26 18.67,8.26 18.16,7.75 v18.16,7.62 | 14.48,7.11 11.94,7.11 11.68,6.86 11.68,5.97 VSELECT.2
VIN
  Top 0.305: U1.3 22.55,6.28 23.14,5.69 23.14,4.49 | 23.24,4.38 24.38,4.38 C12.1
  Top 0.406: POWER1.7 20.32,2.67 20.83,3.17 21.46,3.17 22,3.71 U1.1 23.24,4.38 23.14,4.49
XTAL1
  Top 0.254: U2.7 34.8,12.06 Y2.3
XTAL2
  Top 0.254: Y2.1 32.8,12.05 U2.8

### Text on the board
tPlace: 13 | 12 | 11 | 10 | 9 | 8 | 7 | 6 | 5 | 4 | 3 | 2 | 1 | 0 | Adafruit Clock | TX | RX | ON | RST | Aref | USB | Rst | 3V | 5V | GND | Vin | A0 | A1 | A2 | A3 | SDA | SCL | 5V | GND
bPlace: ATmega328 @16MHz | Vin:5-16VDC | 3v | 5v | Vio | By Wendy Ju / Adapted from / Adafruit Metro Mini
ReferenceLC: PC1 | PC2
200bmp: /Users/wendyju/Pictures/ProfileWendy2.BMP
214bmp: D:/SmartProjects/Snc/a4_bn_logo2.bmp